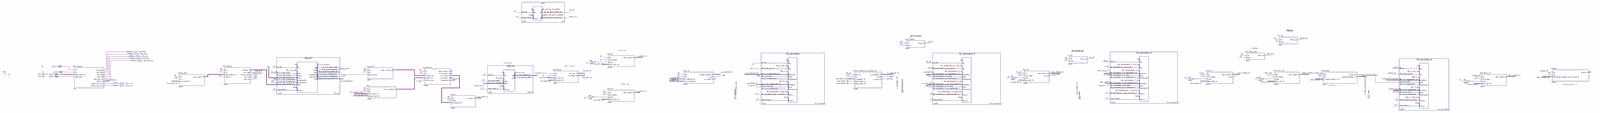
[diagram p0: schematic sheet, whole]
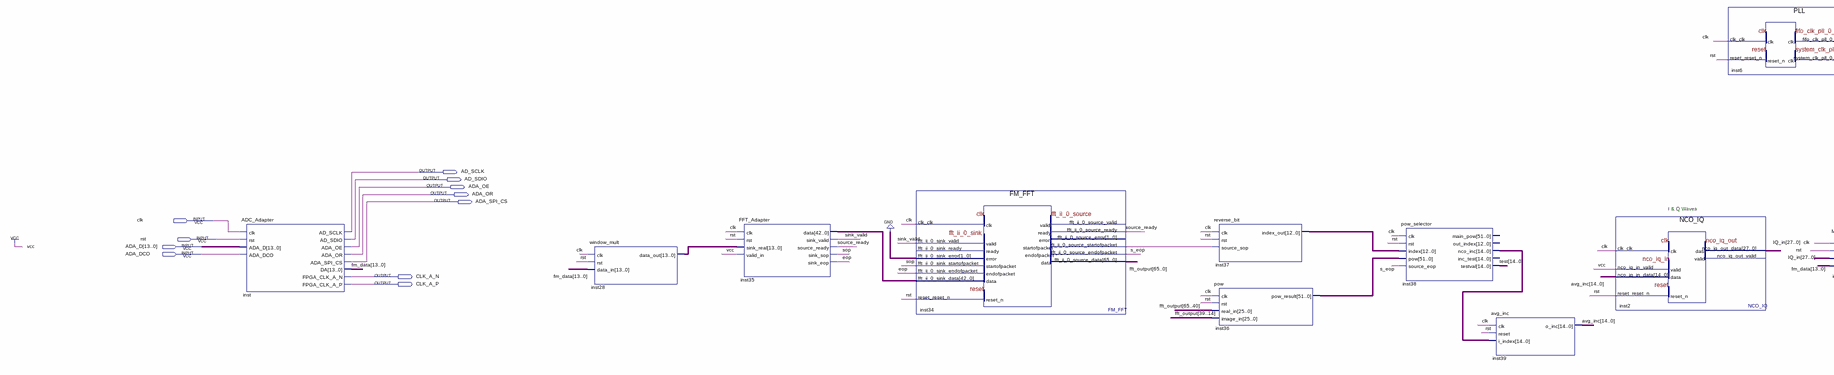
[diagram p1: schematic sheet, left part]
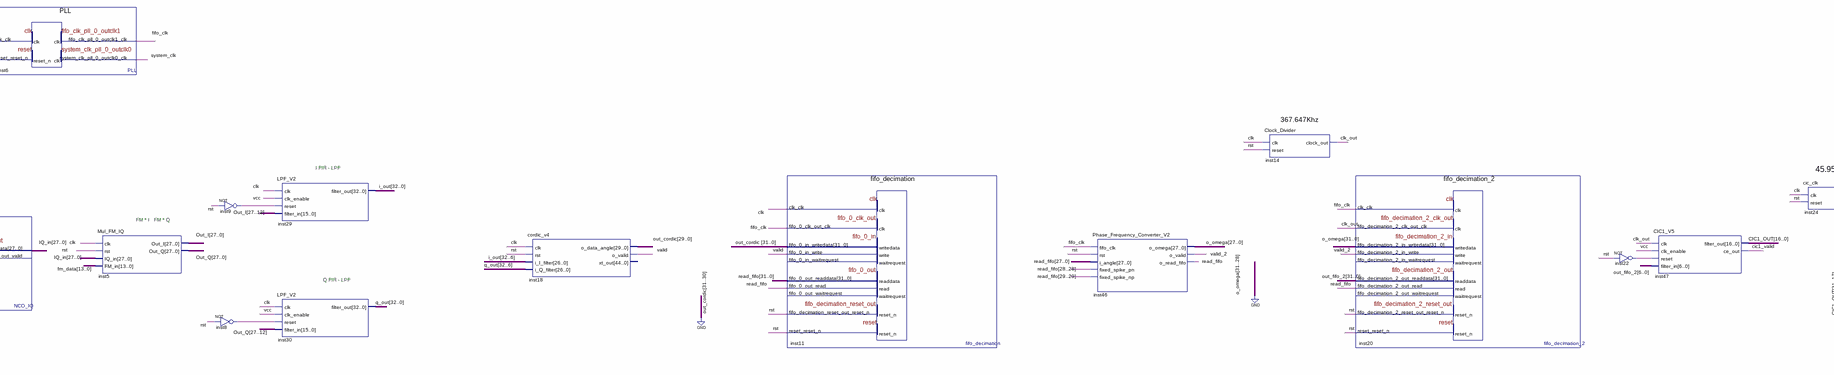
[diagram p2: schematic sheet, centre part]
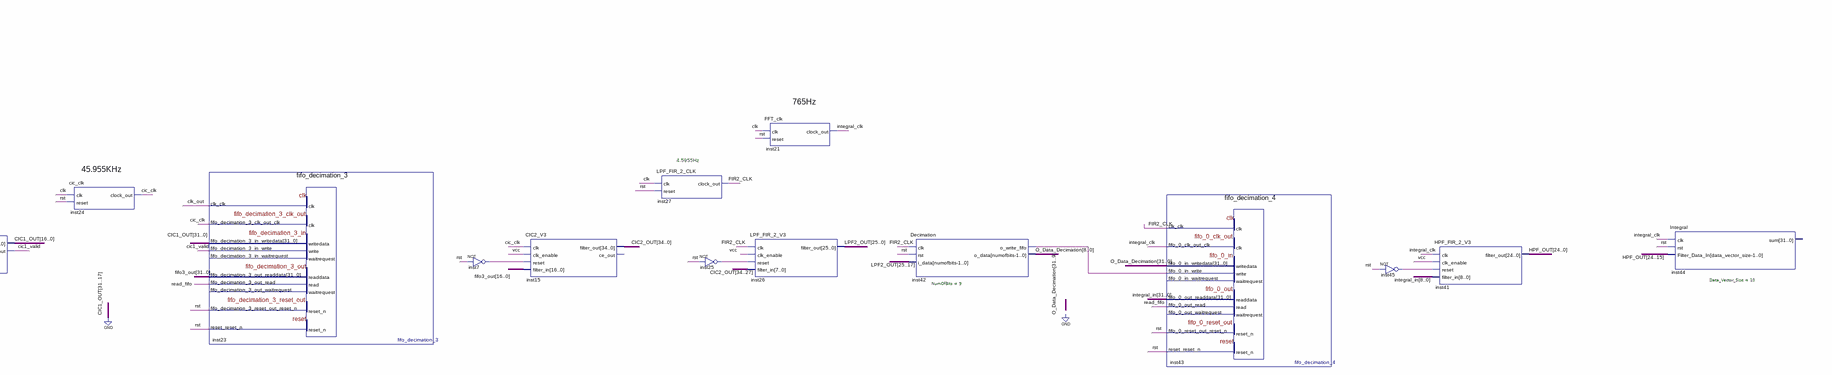
[diagram p3: schematic sheet, right part]
// Quartus schematic ProjectWithSignalGenerator.bdf as structural Verilog: 35 symbols, 11 pins
module ProjectWithSignalGenerator (
  input  clk,
  input  rst,
  input  [13:0] ADA_D,
  input  ADA_DCO,
  output AD_SCLK,
  output AD_SDIO,
  output ADA_OE,
  output ADA_OR,
  output ADA_SPI_CS,
  output CLK_A_N,
  output CLK_A_P
);

  wire cic1_valid, cic_clk, clk_out, eop, fifo_clk, FIR2_CLK, inst7_out, inst8_out, inst9_out, inst22_out,
       inst25_out, inst34_fft_ii_0_source_startofpacket, inst42_o_write_fifo, inst45_out, integral_clk,
       read_fifo_1bit, s_eop, sink_valid, sop, source_ready, system_clk, valid, valid_2;
  wire [12:0] inst37_index_out;
  wire [13:0] fm_data, inst28_data_out;
  wire [14:0] avg_inc, inst38_nco_inc, test;
  wire [16:0] CIC1_OUT;
  wire [24:0] HPF_OUT;
  wire [25:0] LPF2_OUT;
  wire [27:0] IQ_in, o_omega, Out_I, Out_Q;
  wire [29:0] out_cordic;
  wire [31:0] fifo3_out, integral_in, O_Data_Decimation, out_fifo_2, read_fifo;
  wire [32:0] i_out, q_out;
  wire [34:0] CIC2_OUT;
  wire [42:0] inst35_data;
  wire [51:0] inst36_pow_result;
  wire [65:0] fft_output;

  ADC_Adapter inst (
    .clk(clk), .rst(rst), .ADA_D(ADA_D), .ADA_DCO(ADA_DCO), .AD_SCLK(AD_SCLK), .AD_SDIO(AD_SDIO),
    .ADA_OE(ADA_OE), .ADA_OR(ADA_OR), .ADA_SPI_CS(ADA_SPI_CS), .DA(fm_data), .FPGA_CLK_A_N(CLK_A_N),
    .FPGA_CLK_A_P(CLK_A_P));
  window_mult inst28 (.clk(clk), .rst(rst), .data_in(fm_data), .data_out(inst28_data_out));
  FFT_Adapter inst35 (
    .clk(clk), .rst(rst), .sink_real(inst28_data_out), .valid_in(1'b1), .data(inst35_data),
    .sink_valid(sink_valid), .source_ready(source_ready), .sink_sop(sop), .sink_eop(eop));
  FM_FFT inst34 (
    .clk_clk(clk), .fft_ii_0_sink_valid(sink_valid), .fft_ii_0_sink_error(2'b00),
    .fft_ii_0_sink_startofpacket(sop), .fft_ii_0_sink_endofpacket(eop), .fft_ii_0_sink_data(inst35_data),
    .fft_ii_0_source_ready(source_ready), .reset_reset_n(rst),
    .fft_ii_0_source_startofpacket(inst34_fft_ii_0_source_startofpacket),
    .fft_ii_0_source_endofpacket(s_eop), .fft_ii_0_source_data(fft_output));  // open: fft_ii_0_sink_ready, fft_ii_0_source_valid, fft_ii_0_source_error
  reverse_bit inst37 (
    .clk(clk), .rst(rst), .source_sop(inst34_fft_ii_0_source_startofpacket), .index_out(inst37_index_out));
  pow inst36 (
    .clk(clk), .rst(rst), .real_in(fft_output[65:40]), .image_in(fft_output[39:14]),
    .pow_result(inst36_pow_result));
  pow_selector inst38 (
    .clk(clk), .rst(rst), .index(inst37_index_out), .pow(inst36_pow_result), .source_eop(s_eop),
    .nco_inc(inst38_nco_inc), .testval(test));  // open: main_pow, out_index, inc_test
  avg_inc inst39 (.clk(clk), .reset(rst), .i_index(inst38_nco_inc), .o_inc(avg_inc));
  NCO_IQ inst2 (
    .clk_clk(clk), .nco_iq_in_valid(1'b1), .nco_iq_in_data(avg_inc), .reset_reset_n(rst),
    .nco_iq_out_data(IQ_in));  // open: nco_iq_out_valid
  PLL inst6 (
    .clk_clk(clk), .reset_reset_n(rst), .fifo_clk_pll_0_outclk1_clk(fifo_clk),
    .system_clk_pll_0_outclk0_clk(system_clk));
  Mul_FM_IQ inst5 (.clk(clk), .rst(rst), .IQ_in(IQ_in), .FM_in(fm_data), .Out_I(Out_I), .Out_Q(Out_Q));
  not inst9 (inst9_out, rst);
  not inst8 (inst8_out, rst);
  LPF_V2 inst29 (.clk(clk), .clk_enable(1'b1), .reset(inst9_out), .filter_in(Out_I[27:12]), .filter_out(i_out));
  LPF_V2 inst30 (.clk(clk), .clk_enable(1'b1), .reset(inst8_out), .filter_in(Out_Q[27:12]), .filter_out(q_out));
  cordic_v4 inst18 (
    .clk(clk), .rst(rst), .i_I_filter(i_out[32:6]), .i_Q_filter(q_out[32:6]), .o_data_angle(out_cordic),
    .o_valid(valid));  // open: xt_out
  fifo_decimation inst11 (
    .clk_clk(clk), .fifo_0_clk_out_clk(fifo_clk), .fifo_0_in_writedata({2'b00, out_cordic}),
    .fifo_0_in_write(valid), .fifo_0_out_read(read_fifo_1bit), .fifo_decimation_reset_out_reset_n(rst),
    .reset_reset_n(rst), .fifo_0_out_readdata(read_fifo));  // open: fifo_0_in_waitrequest, fifo_0_out_waitrequest
  Phase_Frequency_Converter_V2 inst46 (
    .fifo_clk(fifo_clk), .rst(rst), .i_angle(read_fifo[27:0]), .fixed_spike_pn(read_fifo[28]),
    .fixed_spike_np(read_fifo[29]), .o_omega(o_omega), .o_valid(valid_2), .o_read_fifo(read_fifo_1bit));
  Clock_Divider inst14 (.clk(clk), .reset(rst), .clock_out(clk_out));
  fifo_decimation_2 inst20 (
    .clk_clk(fifo_clk), .fifo_decimation_2_clk_out_clk(clk_out),
    .fifo_decimation_2_in_writedata({4'b0000, o_omega}), .fifo_decimation_2_in_write(valid_2),
    .fifo_decimation_2_out_read(read_fifo_1bit), .fifo_decimation_2_reset_out_reset_n(rst),
    .reset_reset_n(rst), .fifo_decimation_2_out_readdata(out_fifo_2));  // open: fifo_decimation_2_in_waitrequest, fifo_decimation_2_out_waitrequest
  not inst22 (inst22_out, rst);
  CIC1_V5 inst47 (
    .clk(clk_out), .clk_enable(1'b1), .reset(inst22_out), .filter_in(out_fifo_2[6:0]), .filter_out(CIC1_OUT),
    .ce_out(cic1_valid));
  cic_clk inst24 (.clk(clk), .reset(rst), .clock_out(cic_clk));
  fifo_decimation_3 inst23 (
    .clk_clk(clk_out), .fifo_decimation_3_clk_out_clk(cic_clk),
    .fifo_decimation_3_in_writedata({{15{1'b0}}, CIC1_OUT}), .fifo_decimation_3_in_write(cic1_valid),
    .fifo_decimation_3_out_read(read_fifo_1bit), .fifo_decimation_3_reset_out_reset_n(rst),
    .reset_reset_n(rst), .fifo_decimation_3_out_readdata(fifo3_out));  // open: fifo_decimation_3_in_waitrequest, fifo_decimation_3_out_waitrequest
  not inst7 (inst7_out, rst);
  CIC2_V3 inst15 (
    .clk(cic_clk), .clk_enable(1'b1), .reset(inst7_out), .filter_in(fifo3_out[16:0]), .filter_out(CIC2_OUT));  // open: ce_out
  LPF_FIR_2_CLK inst27 (.clk(clk), .reset(rst), .clock_out(FIR2_CLK));
  not inst25 (inst25_out, rst);
  FFT_clk inst21 (.clk(clk), .reset(rst), .clock_out(integral_clk));
  LPF_FIR_2_V3 inst26 (
    .clk(FIR2_CLK), .clk_enable(1'b1), .reset(inst25_out), .filter_in(CIC2_OUT[34:27]), .filter_out(LPF2_OUT));
  Decimation #(.NumOfBits(9)) inst42 (
    .clk(FIR2_CLK), .rst(rst), .i_data(LPF2_OUT[25:17]), .o_write_fifo(inst42_o_write_fifo),
    .o_data(O_Data_Decimation[8:0]));
  fifo_decimation_4 inst43 (
    .clk_clk(FIR2_CLK), .fifo_0_clk_out_clk(integral_clk), .fifo_0_in_writedata(O_Data_Decimation),
    .fifo_0_in_write(inst42_o_write_fifo), .fifo_0_out_read(read_fifo_1bit), .fifo_0_reset_out_reset_n(rst),
    .reset_reset_n(rst), .fifo_0_out_readdata(integral_in));  // open: fifo_0_in_waitrequest, fifo_0_out_waitrequest
  not inst45 (inst45_out, rst);
  HPF_FIR_2_V3 inst41 (
    .clk(integral_clk), .clk_enable(1'b1), .reset(inst45_out), .filter_in(integral_in[8:0]),
    .filter_out(HPF_OUT));
  Integral #(.Data_Vector_Size(10)) inst44 (
    .clk(integral_clk), .rst(rst), .Filter_Data_In(HPF_OUT[24:15]));  // open: sum

  // Notes on the sheet:
  //   765Hz
  //   367.647Khz
  //   4.5955Hz
  //   I FIR - LPF
  //   45.955KHz
  //   I & Q Waves
  //   FM * I   FM * Q
  //   Q FIR - LPF
endmodule
